# Altium project RBB_MCU7_V2.2.PrjPCB
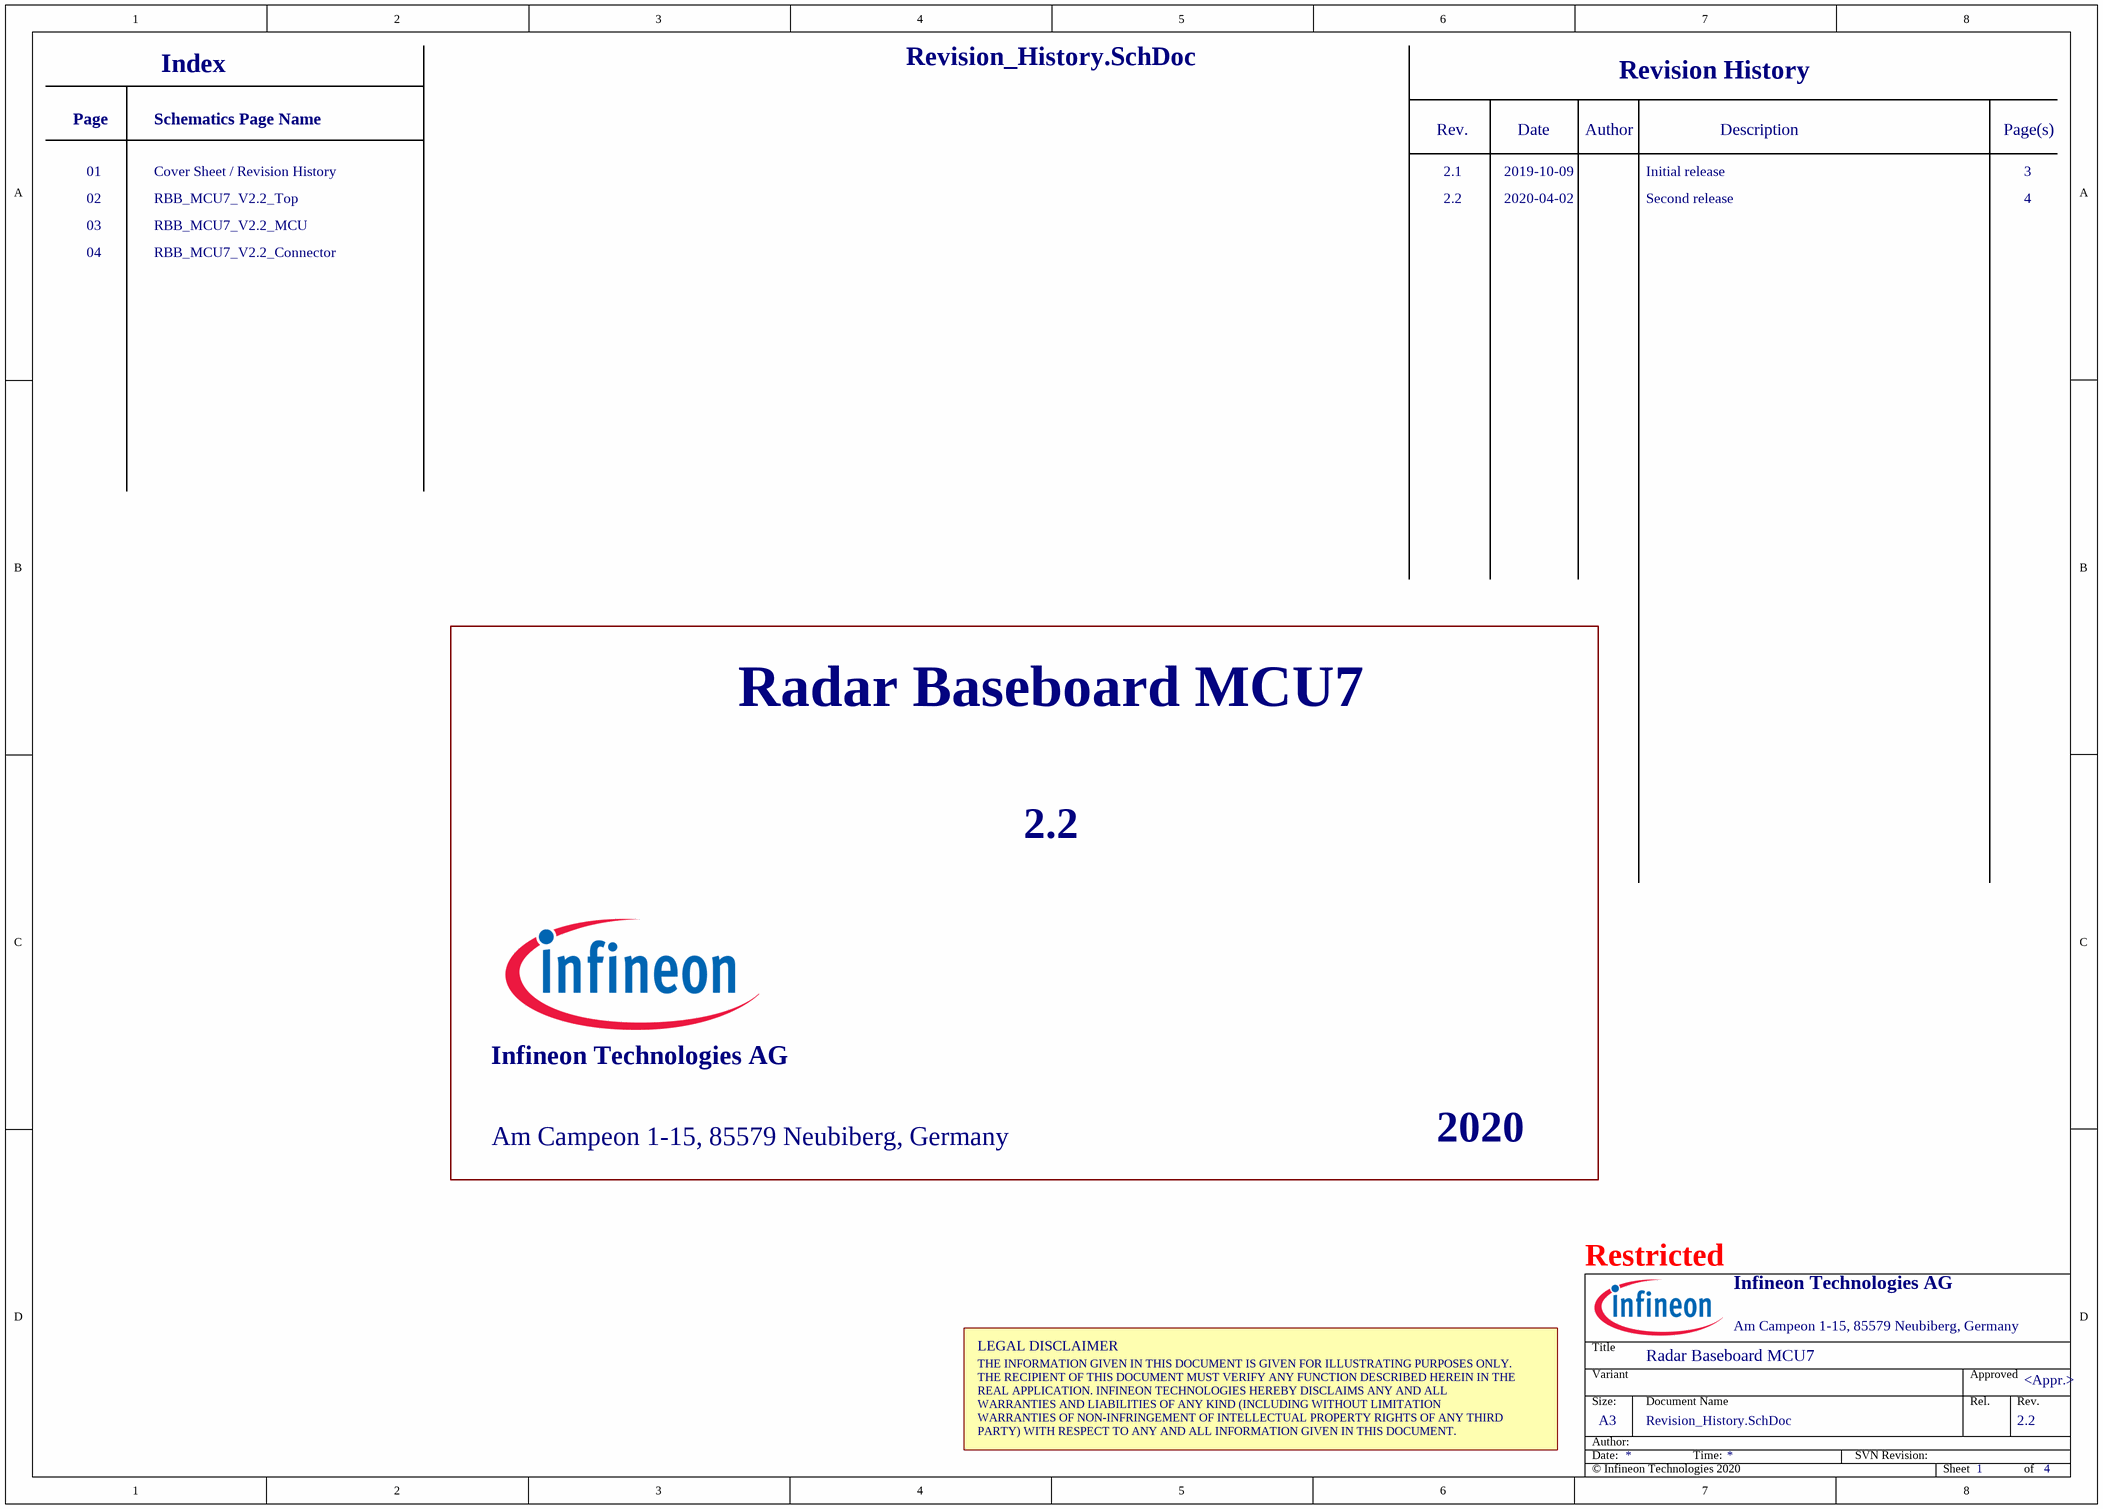
[diagram p0: Revision_History.SchDoc]
PRJ_Year: 2020; PRJ_Title: Radar Baseboard MCU7; PRJ_SCH_Revision: 2.2; PRJ_PCB_Revision: 2.2; PRJ_PCB_Release: 2.2; PRJ_Organization: Infineon Technologies AG; PRJ_Copyright: © Infineon Technologies 2020; PRJ_ConfidentialStatus: Restricted; PRJ_Address2: Am Campeon 1-15, 85579 Neubiberg, Germany
4 sheets, 154 parts. Net scope: hierarchical (ports join the sheet entries above them; power ports are global).
Board file: RBB_MCU7_V2.2.PcbDoc
Sheets:
  Revision_History.SchDoc
  RBB_MCU7_V2.2_Top.SchDoc
    1 = RBB_MCU7_V2.2_MCU.SchDoc
    2 = RBB_MCU7_V2.2_Connector.SchDoc

## Sheet Revision_History.SchDoc: Tjuefire
size A3; ApprovedBy: <Appr.>; Author: <Author>; CompanyName: Infineon Technologies AG; Engineer: <Rel.>; Organization: Infineon Technologies AG; Address1: COM AC SDC SD3; Address2: Am Campeon 1-12  -  85579 Neubiberg  -  Germany; Address3: 85579 Neubiberg; Address4: Germany; DocumentNumber: 1; Revision: <Rev.>; SheetNumber: 1; SheetTotal: 4; Release: RC00; PageSetup: Record=PageOptions|CenterHorizontal=True|CenterVertical=True|PrintScale=1.01|XCorrection=1.00|YCorrection=1.00|PrintKind=0|BorderSize=5000000|LeftOffset=0|BottomOffset=0|Orientation=2|PaperLength=1000|PaperWidth=1000|Scale=100|PaperSource=7|PrintQuality=-4|MediaType=1|DitherType=10|PaperKind=A3|PrintScaleMode=1; Doc_ConfidentialStatus: Confidential; Doc_Preliminary: Preliminary

### Notes on the sheet
- Index
- Revision History
- Page
- 01
- Cover Sheet / Revision History
- Schematics Page Name
- Rev.
- 2.1
- 2019-10-09
- Date
- Author
- Initial release
- Description
- Page(s)
- 3
- 02
- 03
- RBB_MCU7_V2.2_Top
- RBB_MCU7_V2.2_MCU
- 2.2
- 2020-04-02
- Second release
- 4
- 04
- RBB_MCU7_V2.2_Connector
- LEGAL DISCLAIMER
- THE INFORMATION GIVEN IN THIS DOCUMENT IS GIVEN FOR ILLUSTRATING PURPOSES ONLY.
  THE RECIPIENT OF THIS DOCUMENT MUST VERIFY ANY FUNCTION DESCRIBED HEREIN IN THE
  REAL APPLICATION. INFINEON TECHNOLOGIES HEREBY DISCLAIMS ANY AND ALL
  WARRANTIES AND LIABILITIES OF ANY KIND (INCLUDING WITHOUT LIMITATION
  WARRANTIES OF NON-INFRINGEMENT OF INTELLECTUAL PROPERTY RIGHTS OF ANY THIRD
  PARTY) WITH RESPECT TO ANY AND ALL INFORMATION GIVEN IN THIS DOCUMENT.
- Title
- Variant
- Approved
- Date:
- Author:
- Size:
- A3
- Document Name
- Time:
- SVN Revision:
- Rel.
- Sheet
- of

## Sheet RBB_MCU7_V2.2_Top.SchDoc: <Project Name>
size A4; ApprovedBy: <Appr.>; Author: <Author>; CompanyName: Infineon Technologies AG; Engineer: <Rel.>; Organization: Infineon Technologies AG; Address1: IFAG DES S PS; Address2: Am Campeon 1-12  -  85579 Neubiberg  -  Germany; Address3: 85579 Neubiberg; Address4: Germany; Revision: <Rev.>; SheetNumber: 2; SheetTotal: 4; Release: RC00; PageSetup: Record=PageOptions|CenterHorizontal=True|CenterVertical=True|PrintScale=1.01|XCorrection=1.00|YCorrection=1.00|PrintKind=0|BorderSize=5000000|LeftOffset=0|BottomOffset=0|Orientation=2|PaperLength=1000|PaperWidth=1000|Scale=100|PaperSource=7|PrintQuality=-4|MediaType=1|DitherType=10|PaperKind=A3|PrintScaleMode=1; Doc_ConfidentialStatus: <Doc_ConfidentialStatus>; Doc_Preliminary: <Doc_Preliminary>
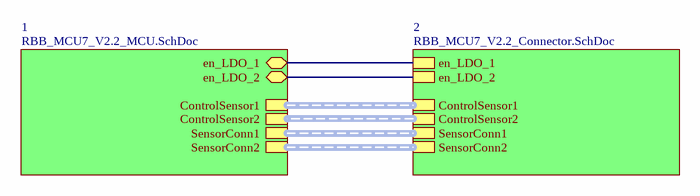
[diagram p1: RBB_MCU7_V2.2_Top.SchDoc]

### Sub-sheets
1 = RBB_MCU7_V2.2_MCU.SchDoc: en_LDO_1 (bidir), en_LDO_2 (bidir), SensorConn2 (harness SensorConn2), SensorConn1 (harness SensorConn1), ControlSensor1 (harness ControlSensor1), ControlSensor2 (harness ControlSensor2)
2 = RBB_MCU7_V2.2_Connector.SchDoc: en_LDO_1, en_LDO_2, SensorConn1 (harness SensorConn1), SensorConn2 (harness SensorConn2), ControlSensor1 (harness ControlSensor1), ControlSensor2 (harness ControlSensor2)

### Nets
en_LDO_1: sheet 1/en_LDO_1, sheet 2/en_LDO_1
en_LDO_2: sheet 1/en_LDO_2, sheet 2/en_LDO_2

### Buses and harness runs
harness sheet 1/ControlSensor1 = sheet 2/ControlSensor1
harness sheet 1/ControlSensor2 = sheet 2/ControlSensor2
harness sheet 1/SensorConn1 = sheet 2/SensorConn1
harness sheet 1/SensorConn2 = sheet 2/SensorConn2

### Notes on the sheet
- Title
- Variant
- Approved
- Date:
- Author:
- Size:
- A4
- Document Name
- Time:
- SVN Revision:
- Rel.
- Rev.
- Sheet
- of

## Sheet RBB_MCU7_V2.2_MCU.SchDoc: <Project Name>
size A3; ApprovedBy: <Appr.>; Author: <Author>; CompanyName: Infineon Technologies AG; Engineer: <Rel.>; Organization: Infineon Technologies AG; Address1: IFAG DES S PS; Address2: Am Campeon 1-12  -  85579 Neubiberg  -  Germany; Address3: 85579 Neubiberg; Address4: Germany; Revision: <Rev.>; SheetNumber: 3; SheetTotal: 4; Release: RC00; PageSetup: Record=PageOptions|CenterHorizontal=True|CenterVertical=True|PrintScale=1.01|XCorrection=1.00|YCorrection=1.00|PrintKind=0|BorderSize=5000000|LeftOffset=0|BottomOffset=0|Orientation=2|PaperLength=1000|PaperWidth=1000|Scale=100|PaperSource=7|PrintQuality=-4|MediaType=1|DitherType=10|PaperKind=A3|PrintScaleMode=1; Doc_ConfidentialStatus: <Doc_ConfidentialStatus>; Doc_Preliminary: <Doc_Preliminary>
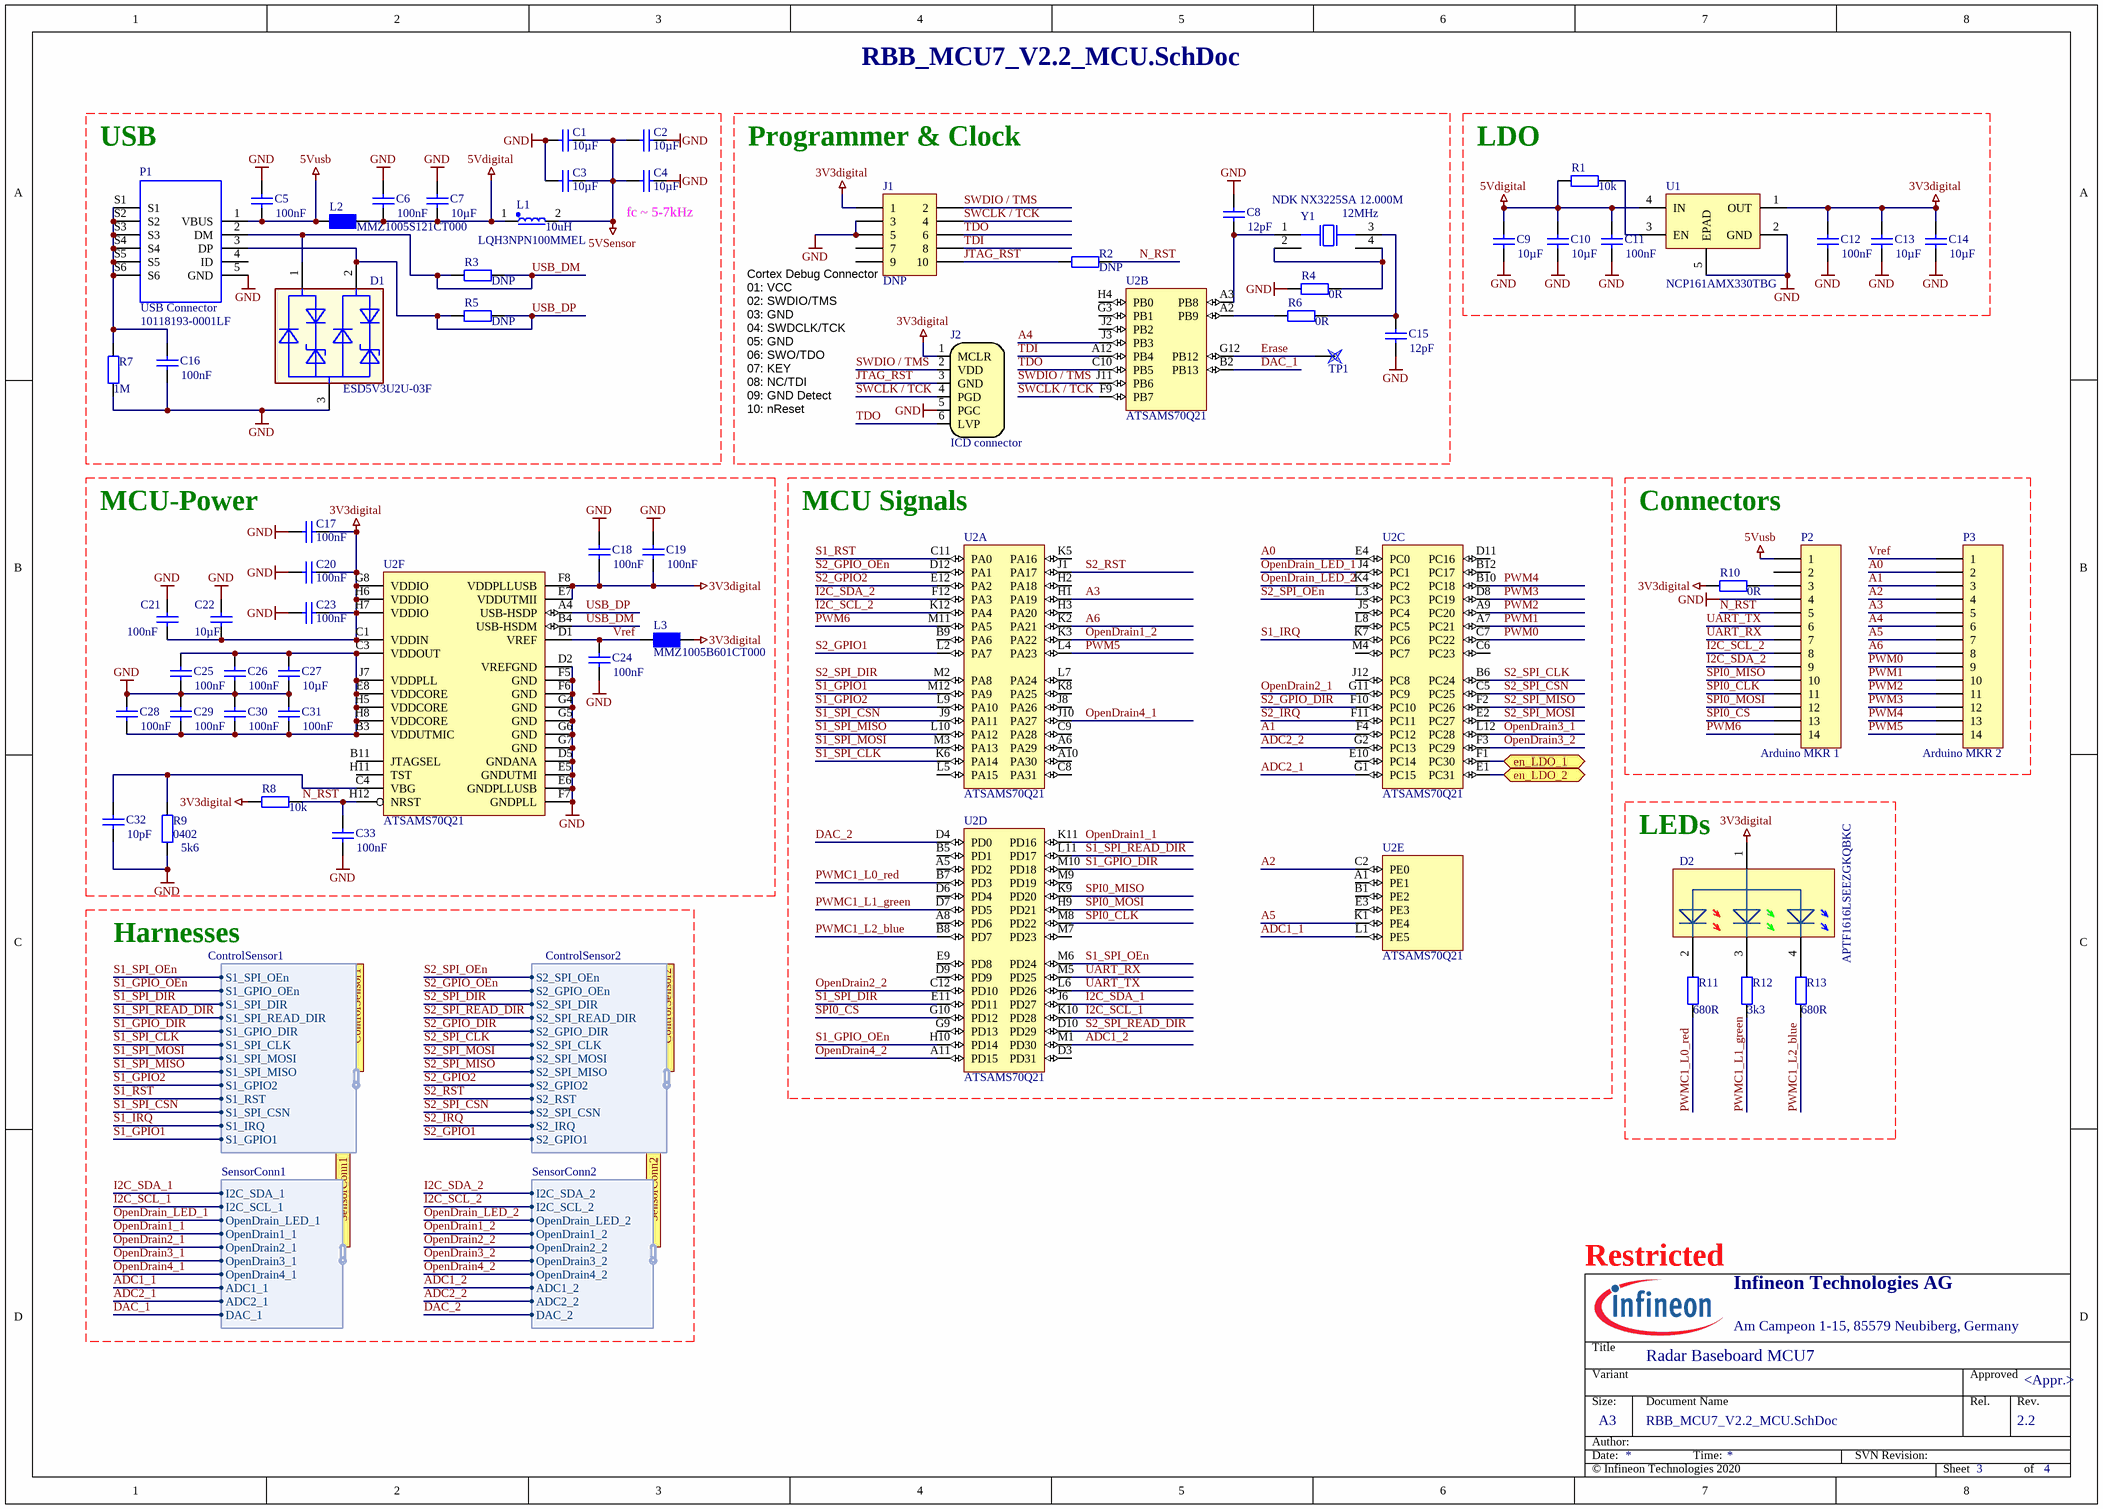
[diagram p2: RBB_MCU7_V2.2_MCU.SchDoc]

### Parts
C1  10µF  [0402_C_Axon]
C2  10µF  [0402_C_Axon]
C3  10µF  [0402_C_Axon]
C4  10µF  [0402_C_Axon]
C5  100nF  [0402_C_Axon]
C6  100nF  [0402_C_Axon]
C7  10µF  [0402_C_Axon]
C8  12pF  [0402_C_Axon]
C9  10µF  [0402_C_Axon]
C10  10µF  [0402_C_Axon]
C11  100nF  [0402_C_Axon]
C12  100nF  [0402_C_Axon]
C13  10µF  [0402_C_Axon]
C14  10µF  [0402_C_Axon]
C15  12pF  [0402_C_Axon]
C16  100nF  [0402_C_Axon]
C17  100nF  [0402_C_Axon]
C18  100nF  [0402_C_Axon]
C19  100nF  [0402_C_Axon]
C20  100nF  [0402_C_Axon]
C21  100nF  [0402_C_Axon]
C22  10µF  [0402_C_Axon]
C23  100nF  [0402_C_Axon]
C24  100nF  [0402_C_Axon]
C25  100nF  [0402_C_Axon]
C26  100nF  [0402_C_Axon]
C27  10µF  [0402_C_Axon]
C28  100nF  [0402_C_Axon]
C29  100nF  [0402_C_Axon]
C30  100nF  [0402_C_Axon]
C31  100nF  [0402_C_Axon]
C32  10pF  [0402_C_Axon]
C33  100nF  [0402_C_Axon]
D1  ESD5V3U2U-03F  [SOTFL40P120X59-3N-V]
D2  APTF1616LSEEZGKQBKC  [APTF1616LSEEZGKQBKC]
J1  DNP  [Samtec FTSH-105-01-L-DV-K - no3D]
J2  value ICD connector  [TC2030-MCP-NL]  (hidden comment: DNP)  (no BOM)
L1  LQH3NPN100MMEL  value 10uH  [INDC3030X150N_LQH3NP_MR]
L2  MMZ1005S121CT000  [0402_L_Axon]
L3  MMZ1005B601CT000  [0402_L_Axon]
P1  10118193-0001LF  value USB Connector  [CON_FCI_10118193]
P2  value Arduino MKR 1  [HDR1X14TOPBOTTOM]  (hidden comment: DNP)
P3  value Arduino MKR 2  [HDR1X14TOPBOTTOM]  (hidden comment: DNP)
R1  10k  [0402_R_Axon]
R2  DNP  [0402_Empty_Axon]
R3  DNP  [0402_Empty_Axon]
R4  0R  [0402_R_Axon]
R5  DNP  [0402_Empty_Axon]
R6  0R  [0402_R_Axon]
R7  1M  [0402_R_Axon]
R8  10k  [0402_R_Axon]
R9  5k6  value 0402  [0402_R_Axon]
R10  0R  [0402_R_Axon]
R11  680R  [0402_R_Axon]
R12  3k3  [0402_R_Axon]
R13  680R  [0402_R_Axon]
TP1  Testpoint  [TP1.5MM]  (value not drawn)  (no BOM)
U1  NCP161AMX330TBG  [NCP163]
U2  ATSAMS70Q21  [LFBGA144]  (parts A,B,C,D,E,F of 6)
Y1  12MHz  Legacy DeviceID: NDK NX3225SA 12.000M  [XTAL-SMD-NX3225SA]

### Ports
ControlSensor1 (harness ControlSensor1), ControlSensor2 (harness ControlSensor2), en_LDO_1 (bidir), en_LDO_2 (bidir), SensorConn1 (harness SensorConn1), SensorConn2 (harness SensorConn2)

### Harnesses
ControlSensor1: S1_SPI_CLK, S1_SPI_MOSI, S1_SPI_MISO, S1_GPIO2, S1_RST, S1_SPI_CSN, S1_IRQ, S1_GPIO1, S1_SPI_OEn, S1_GPIO_OEn, S1_SPI_DIR, S1_SPI_READ_DIR, S1_GPIO_DIR
SensorConn1: I2C_SDA_1, I2C_SCL_1, OpenDrain_LED_1, OpenDrain1_1, OpenDrain2_1, OpenDrain3_1, OpenDrain4_1, ADC1_1, ADC2_1, DAC_1
SensorConn2: I2C_SDA_2, I2C_SCL_2, OpenDrain_LED_2, OpenDrain1_2, OpenDrain2_2, OpenDrain3_2, OpenDrain4_2, ADC1_2, ADC2_2, DAC_2
ControlSensor2: S2_SPI_CLK, S2_SPI_MOSI, S2_SPI_MISO, S2_GPIO2, S2_RST, S2_SPI_CSN, S2_IRQ, S2_GPIO1, S2_SPI_OEn, S2_GPIO_OEn, S2_SPI_DIR, S2_SPI_READ_DIR, S2_GPIO_DIR

### Nets
3V3digital: C12.2 C13.2 C14.2 C17.1 C18.1 C19.1 C20.1 C21.1 C22.1 C23.1 D2.1 J1.1 J2.1(MCLR) L3.1 R8.1 R10.2 U1.1(OUT) U2.C1(VDDIN) U2.E7(VDDUTMII) U2.F8(VDDPLLUSB) U2.G8(VDDIO) U2.H6(VDDIO) U2.H7(VDDIO)
5Vdigital: C6.2 C7.2 C9.2 C10.2 C11.2 L1.1 L2.2 R1.2 U1.4(IN)
5VSensor: C1.2 C2.2 C3.2 C4.2 L1.2
5Vusb: C5.2 L2.1 P1.1(VBUS) P2.1
GND: C1.1 C2.1 C3.1 C4.1 C5.1 C6.1 C7.1 C8.1 C9.1 C10.1 C11.1 C12.1 C13.1 C14.1 C15.2 C16.2 C17.2 C18.2 C19.2 C20.2 C21.2 C22.2 C23.2 C24.1 C25.1 C26.1 C27.2 C28.2 C29.2 C30.2 C31.2 C32.1 C33.1 D1.3 J1.3 J1.5 J2.5(PGC) P1.5(GND) P2.4 R4.2 R7.1 R9.2 U1.2(GND) U1.5(EPAD) U2.D2(VREFGND) U2.D5(GNDANA) U2.E5(GNDUTMI) U2.E6(GNDPLLUSB) U2.F5(GND) U2.F6(GND) U2.F7(GNDPLL) U2.G4(GND) U2.G5(GND) U2.G6(GND) U2.G7(GND)
A0: P3.2 U2.E4(PC0)
A1: P3.3 U2.F4(PC12)
A2: P3.4 U2.C2(PE0)
A3: P3.5 U2.H1(PA19)
A4: P3.6 U2.J3(PB3)
A5: P3.7 U2.K1(PE4)
A6: P3.8 U2.K2(PA21)
ADC1_1: U2.L1(PE5) ; port SensorConn1.ADC1_1
ADC1_2: U2.M1(PD30) ; port SensorConn2.ADC1_2
ADC2_1: U2.G1(PC15) ; port SensorConn1.ADC2_1
ADC2_2: U2.G2(PC13) ; port SensorConn2.ADC2_2
DAC_1: U2.B2(PB13) ; port SensorConn1.DAC_1
DAC_2: U2.D4(PD0) ; port SensorConn2.DAC_2
en_LDO_1: U2.F1(PC30) ; port en_LDO_1
en_LDO_2: U2.E1(PC31) ; port en_LDO_2
Erase: TP1.1 U2.G12(PB12)
I2C_SCL_1: U2.K10(PD28) ; port SensorConn1.I2C_SCL_1
I2C_SCL_2: P2.8 U2.K12(PA4) ; port SensorConn2.I2C_SCL_2
I2C_SDA_1: U2.J6(PD27) ; port SensorConn1.I2C_SDA_1
I2C_SDA_2: P2.9 U2.F12(PA3) ; port SensorConn2.I2C_SDA_2
JTAG_RST: J1.10 J2.3(GND) R2.2
N_RST: C33.2 P2.5 R2.1 R8.2 U2.H12(NRST)
OpenDrain1_1: U2.K11(PD16) ; port SensorConn1.OpenDrain1_1
OpenDrain1_2: U2.K3(PA22) ; port SensorConn2.OpenDrain1_2
OpenDrain2_1: U2.G11(PC9) ; port SensorConn1.OpenDrain2_1
OpenDrain2_2: U2.C12(PD10) ; port SensorConn2.OpenDrain2_2
OpenDrain3_1: U2.L12(PC28) ; port SensorConn1.OpenDrain3_1
OpenDrain3_2: U2.F3(PC29) ; port SensorConn2.OpenDrain3_2
OpenDrain4_1: U2.J10(PA27) ; port SensorConn1.OpenDrain4_1
OpenDrain4_2: U2.A11(PD15) ; port SensorConn2.OpenDrain4_2
OpenDrain_LED_1: U2.J4(PC1) ; port SensorConn1.OpenDrain_LED_1
OpenDrain_LED_2: U2.K4(PC2) ; port SensorConn2.OpenDrain_LED_2
PWM0: P3.9 U2.C7(PC22)
PWM1: P3.10 U2.A7(PC21)
PWM2: P3.11 U2.A9(PC20)
PWM3: P3.12 U2.D8(PC19)
PWM4: P3.13 U2.B10(PC18)
PWM5: P3.14 U2.L4(PA23)
PWM6: P2.14 U2.M11(PA5)
PWMC1_L0_red: R11.1 U2.B7(PD3)
PWMC1_L1_green: R12.1 U2.D7(PD5)
PWMC1_L2_blue: R13.1 U2.B8(PD7)
S1_GPIO1: U2.M12(PA9) ; port ControlSensor1.S1_GPIO1
S1_GPIO2: U2.L9(PA10) ; port ControlSensor1.S1_GPIO2
S1_GPIO_DIR: U2.M10(PD18) ; port ControlSensor1.S1_GPIO_DIR
S1_GPIO_OEn: U2.H10(PD14) ; port ControlSensor1.S1_GPIO_OEn
S1_IRQ: U2.K7(PC6) ; port ControlSensor1.S1_IRQ
S1_RST: U2.C11(PA0) ; port ControlSensor1.S1_RST
S1_SPI_CLK: U2.K6(PA14) ; port ControlSensor1.S1_SPI_CLK
S1_SPI_CSN: U2.J9(PA11) ; port ControlSensor1.S1_SPI_CSN
S1_SPI_DIR: U2.E11(PD11) ; port ControlSensor1.S1_SPI_DIR
S1_SPI_MISO: U2.L10(PA12) ; port ControlSensor1.S1_SPI_MISO
S1_SPI_MOSI: U2.M3(PA13) ; port ControlSensor1.S1_SPI_MOSI
S1_SPI_OEn: U2.M6(PD24) ; port ControlSensor1.S1_SPI_OEn
S1_SPI_READ_DIR: U2.L11(PD17) ; port ControlSensor1.S1_SPI_READ_DIR
S2_GPIO1: U2.L2(PA7) ; port ControlSensor2.S2_GPIO1
S2_GPIO2: U2.E12(PA2) ; port ControlSensor2.S2_GPIO2
S2_GPIO_DIR: U2.F10(PC10) ; port ControlSensor2.S2_GPIO_DIR
S2_GPIO_OEn: U2.D12(PA1) ; port ControlSensor2.S2_GPIO_OEn
S2_IRQ: U2.F11(PC11) ; port ControlSensor2.S2_IRQ
S2_RST: U2.J1(PA17) ; port ControlSensor2.S2_RST
S2_SPI_CLK: U2.B6(PC24) ; port ControlSensor2.S2_SPI_CLK
S2_SPI_CSN: U2.C5(PC25) ; port ControlSensor2.S2_SPI_CSN
S2_SPI_DIR: U2.M2(PA8) ; port ControlSensor2.S2_SPI_DIR
S2_SPI_MISO: U2.F2(PC26) ; port ControlSensor2.S2_SPI_MISO
S2_SPI_MOSI: U2.E2(PC27) ; port ControlSensor2.S2_SPI_MOSI
S2_SPI_OEn: U2.L3(PC3) ; port ControlSensor2.S2_SPI_OEn
S2_SPI_READ_DIR: U2.D10(PD29) ; port ControlSensor2.S2_SPI_READ_DIR
SPI0_CLK: P2.11 U2.M8(PD22)
SPI0_CS: P2.13 U2.G10(PD12)
SPI0_MISO: P2.10 U2.K9(PD20)
SPI0_MOSI: P2.12 U2.H9(PD21)
SWCLK / TCK: J1.4 J2.4(PGD) U2.F9(PB7)
SWDIO / TMS: J1.2 J2.2(VDD) U2.J11(PB6)
TDI: J1.8 U2.A12(PB4)
TDO: J1.6 J2.6(LVP) U2.C10(PB5)
UART_RX: P2.7 U2.M5(PD25)
UART_TX: P2.6 U2.L6(PD26)
USB_DM: D1.1 P1.2(DM) R3.1 R3.2 U2.B4(USB-HSDM)
USB_DP: D1.2 P1.3(DP) R5.1 R5.2 U2.A4(USB-HSDP)
Vref: C24.2 L3.2 P3.1 U2.D1(VREF)
NetC8_2: C8.2 U2.A3(PB8) Y1.1
NetC15_1: C15.1 R6.1 Y1.3
NetC16_1: C16.1 P1.S1 P1.S2 P1.S3 P1.S4 P1.S5 P1.S6 R7.2
NetC25_2: C25.2 C26.2 C27.1 C28.1 C29.1 C30.1 C31.1 U2.B3(VDDUTMIC) U2.C3(VDDOUT) U2.E8(VDDCORE) U2.H5(VDDCORE) U2.H8(VDDCORE) U2.J7(VDDPLL)
NetC32_2: C32.2 R9.1 U2.C4(VBG)
NetD2_2: D2.2 R11.2
NetD2_3: D2.3 R12.2
NetD2_4: D2.4 R13.2
NetP2_3: P2.3 R10.1
NetR1_1: R1.1 U1.3(EN)
NetR4_1: R4.1 Y1.2 Y1.4
NetR6_2: R6.2 U2.A2(PB9)

Not connected (* = marked no-connect by the designer): J1 7 9; P1 4(ID); P2 2; U2 A1(PE1) A5(PD2) A6(PA29) A8(PD6) A10(PA30) B1(PE2) B5(PD1) B9(PA6) B11(JTAGSEL) B12(PC17) C6(PC23) C8(PA31) C9(PA28) D3(PD31) D6(PD4) D9(PD9) D11(PC16) E3(PE3) E9(PD8) E10(PC14) G3(PB1) G9(PD13) H2(PA18) H3(PA20) H4(PB0) H11(TST) J2(PB2) J5(PC4) J8(PA26) J12(PC8) K5(PA16) K8(PA25) L5(PA15) L7(PA24) L8(PC5) M4(PC7) M7(PD23) M9(PD19)

### Notes on the sheet
- USB
- Programmer & Clock
- LDO
- (near C4) fc ~ 5-7kHz
- (near J1) Cortex Debug Connector
- 01: VCC
- 02: SWDIO/TMS
- 03: GND
- 04: SWDCLK/TCK
- 05: GND
- 06: SWO/TDO
- 07: KEY
- 08: NC/TDI
- 09: GND Detect
- 10: nReset
- MCU-Power
- MCU Signals
- Connectors
- (near D2) LEDs
- Harnesses
- Title
- Variant
- Approved
- Date:
- Author:
- Size:
- A3
- Document Name
- Time:
- SVN Revision:
- Rel.
- Rev.
- Sheet
- of

### Library data of the parts
C1-C33 = Cap: Capacitor; Value: 0402; Published: 8-Jun-2000; LatestRevisionDate: 17-Jul-2002; LatestRevisionNote: Re-released for DXP Platform.; PackageReference: RAD-0.3; Publisher: Altium Limited; PackageDescription: Radial Cap, Thru-Hole; 2 Leads; 0.3 in Pin Spacing
D1 = 427307: Ultra-Low ESD / Transient Protection Diode, Uni-Directional, VRWM 5.3V; Legacy PartNumber: IFX01400970; Manufacturer: Infineon Technologies; Manufacturer Component Status: Active; Symbol Type: 2 Lines Uni-directional Transient Voltage Suppressor Diode, 3 Pins; Alternate View: No; Article Number: 427307; Version Number: V01; Combined Parameters: Vf:-;If:-;Ur:5.3V;Ir:50nA;Pmax:-; Type: TVS Diode; Style: Single; ComponentStatus: Released; Second Source allowed: Yes; Multiple Part: No; Legacy DeviceID: IFX01400970; Part Type: Diode; Manufacturer Order Number: ESD5V3U2U-03F; Value: ESD5V3U2U-03F; Application: Protection; Temperature min: -40; Temperature max: 125; Temperature Range: Automotive; RoHS Compliant: Y; Automotive Qualified: No; PackageReference: TSFP-3-1; ComponentLink1Description: Vendor WebSite; ComponentLink1URL: https://www.infineon.com/; ComponentLink2Description: Datasheet; ComponentLink2URL: http://webnetprod.muc.infineon.com/pcbportal_prod/WorkFlows/AltiumComponent/StandardDocumentation?Versionid=427308; Supplier 1: Farnell; Supplier 2: DigiKey; Supplier Part Number 2: ESD5V3U2U03FH6327XTSA1TR-ND; Supplier 3: Mouser; Supplier Part Number 3: 726-5V3U2U03FH6327XT
D2 = APTF1616LSEEZGKQBKC: Kingbright - APTF1616LSEEZGKQBKC
J1 = Header 5X2: Header, 5-Pin, Dual row, SMD; Bestellnummer: FTSH-105-01-L-DV-K; Hersteller: Samtec; Notes: without Pin 7; Preis: 1.525; Distributor: Samtec; FootprintBOM: SMD; Kleinmengendistributor: Samtec; KleinmengendistributorBestellnummer: FTSH-105-01-L-DV-K
J2 = TC2030-MCP-NL: Conector par ICD
L1 = 316693: for Power Line; Multiple Parts: No; Legacy PartNumber: IND00700877; Manufacturer: muRata; Manufacturer Order Number: LQH3NPN100MMR; Manufacturer Component Status: Active; Symbol Type: Inductor; Single; Standard; Polarized; Core; 2 Pins; Alternate View: Yes; Article Number: 316693; Version Number: V01; Tolerance Neg: 20%; Combined Parameters: Tol.:-20%/+20%;Rdc:252mR;Idc:1.15A;Fres:30MHz; Style: Single; Voltage DC (max): na; Legacy DeviceID: IND00700877; Part Type: Inductor; Tolerance Pos: 20%; Type: LQH3NPN100MMEL; Technology: Wire Wound; Temperature min: -40; Temperature max: 85; Temperature Range: Industrial; RoHS Compliant: Y; Automotive Qualified: No; PackageReference: 3030 (1212); ComponentLink1Description: Vendor WebSite; ComponentLink1URL: http://www.murata.com; ComponentLink2Description: Datasheet; ComponentLink2URL: http://webnetprod.muc.infineon.com/pcbportal_prod/WorkFlows/AltiumComponent/StandardDocumentation?Versionid=316694; Supplier 1: Farnell; Supplier 2: DigiKey; Supplier 3: Mouser; PLMStatus: Active; Second Source allowed: Yes; Package Description: Inductor,Chip;3.00mm L X 3.00mm W X 1.50mm H
L2 L3 = INDUCTOR1: SMD Ferrite Bead; Preis: 0; Hersteller: Würth; FootprintBOM: 0805; Kleinmengendistributor: Digi-Key; KleinmengendistributorBestellnummer: 732-1601-1-ND
P1 = FCI_10118193: USB Micro B Receptacle, Right Angle, SMD w/2 DIP Legs; Manufacturer: FCI; OrderNr: 649-10118193-0001LF; Manufacturer Part Number: 10118193-0001LF; Distributor: Mouser; ManufacturerPartNo: 10118193-0001LF; ManufacturerPartNumber: 10118193-0001LF; PackageDescription: Connector; PackageReference: USB
P2 P3 = Header 14: Header, 14-Pin; LatestRevisionDate: 17-Jul-2002; LatestRevisionNote: Re-released for DXP Platform.; Publisher: Altium Limited
R1-R8 R10-R13 = Res2: Resistor; Value: 0402
R9 = Res2: Resistor
TP1 = P_PRUEFPAD: FootprintBOM: Testpoint; Preis: -
U1 = NCP177: NCP161 - LDO 450mA, XDFN4 / ultra-low noise, high PSRR
Y1 = 409657: SMD Crystal Unit for Automotive Application, 12.000MHz; Legacy PartNumber: IC02600619; Manufacturer: Nihon Dempa Kogyo; Manufacturer Order Number: NX3225SA-12.000M-STD-CRS-2; Manufacturer Component Status: Active; Symbol type: Standard Crystal Symbol, 4 Pins; Article Number: 409657; Version Number: V01; Tolerance Neg: 50%; Combined Parameters: Standard Standard Crystal;Tol.:-50%/+50%; Style: Standard; Automotive Qualified: AEC Q200; ComponentStatus: Released; Second Source allowed: Yes; Part Type: Clock; Value: 12MHz; Tolerance Pos: 50%; Type: Crystal; Application: Standard; Temperature min: -40; Temperature max: 125; Temperature Range: Automotive; RoHS Compliant: Y; PackageReference: SMD 3.2 x 2.5 x 0.6mm; ComponentLink1Description: Vendor WebSite; ComponentLink1URL: http://www.ndk.com/en/; ComponentLink2Description: Datasheet; ComponentLink2URL: http://webnetprod.muc.infineon.com/pcbportal_prod/WorkFlows/AltiumComponent/StandardDocumentation?Versionid=409658; Supplier 1: Farnell; Supplier 2: DigiKey; Supplier Part Number 2: 644-1128-2-ND; Supplier 3: Mouser
U2 = ATSAMS70Q21: Value: ATSAMS70Q21

## Sheet RBB_MCU7_V2.2_Connector.SchDoc: <Project Name>
size A3; ApprovedBy: <Appr.>; Author: <Author>; CompanyName: Infineon Technologies AG; Engineer: <Rel.>; Organization: Infineon Technologies AG; Address1: IFAG DES S PS; Address2: Am Campeon 1-12  -  85579 Neubiberg  -  Germany; Address3: 85579 Neubiberg; Address4: Germany; Revision: <Rev.>; SheetNumber: 4; SheetTotal: 4; Release: RC00; PageSetup: Record=PageOptions|CenterHorizontal=True|CenterVertical=True|PrintScale=1.01|XCorrection=1.00|YCorrection=1.00|PrintKind=0|BorderSize=5000000|LeftOffset=0|BottomOffset=0|Orientation=2|PaperLength=1000|PaperWidth=1000|Scale=100|PaperSource=7|PrintQuality=-4|MediaType=1|DitherType=10|PaperKind=A3|PrintScaleMode=1; Doc_ConfidentialStatus: <Doc_ConfidentialStatus>; Doc_Preliminary: <Doc_Preliminary>
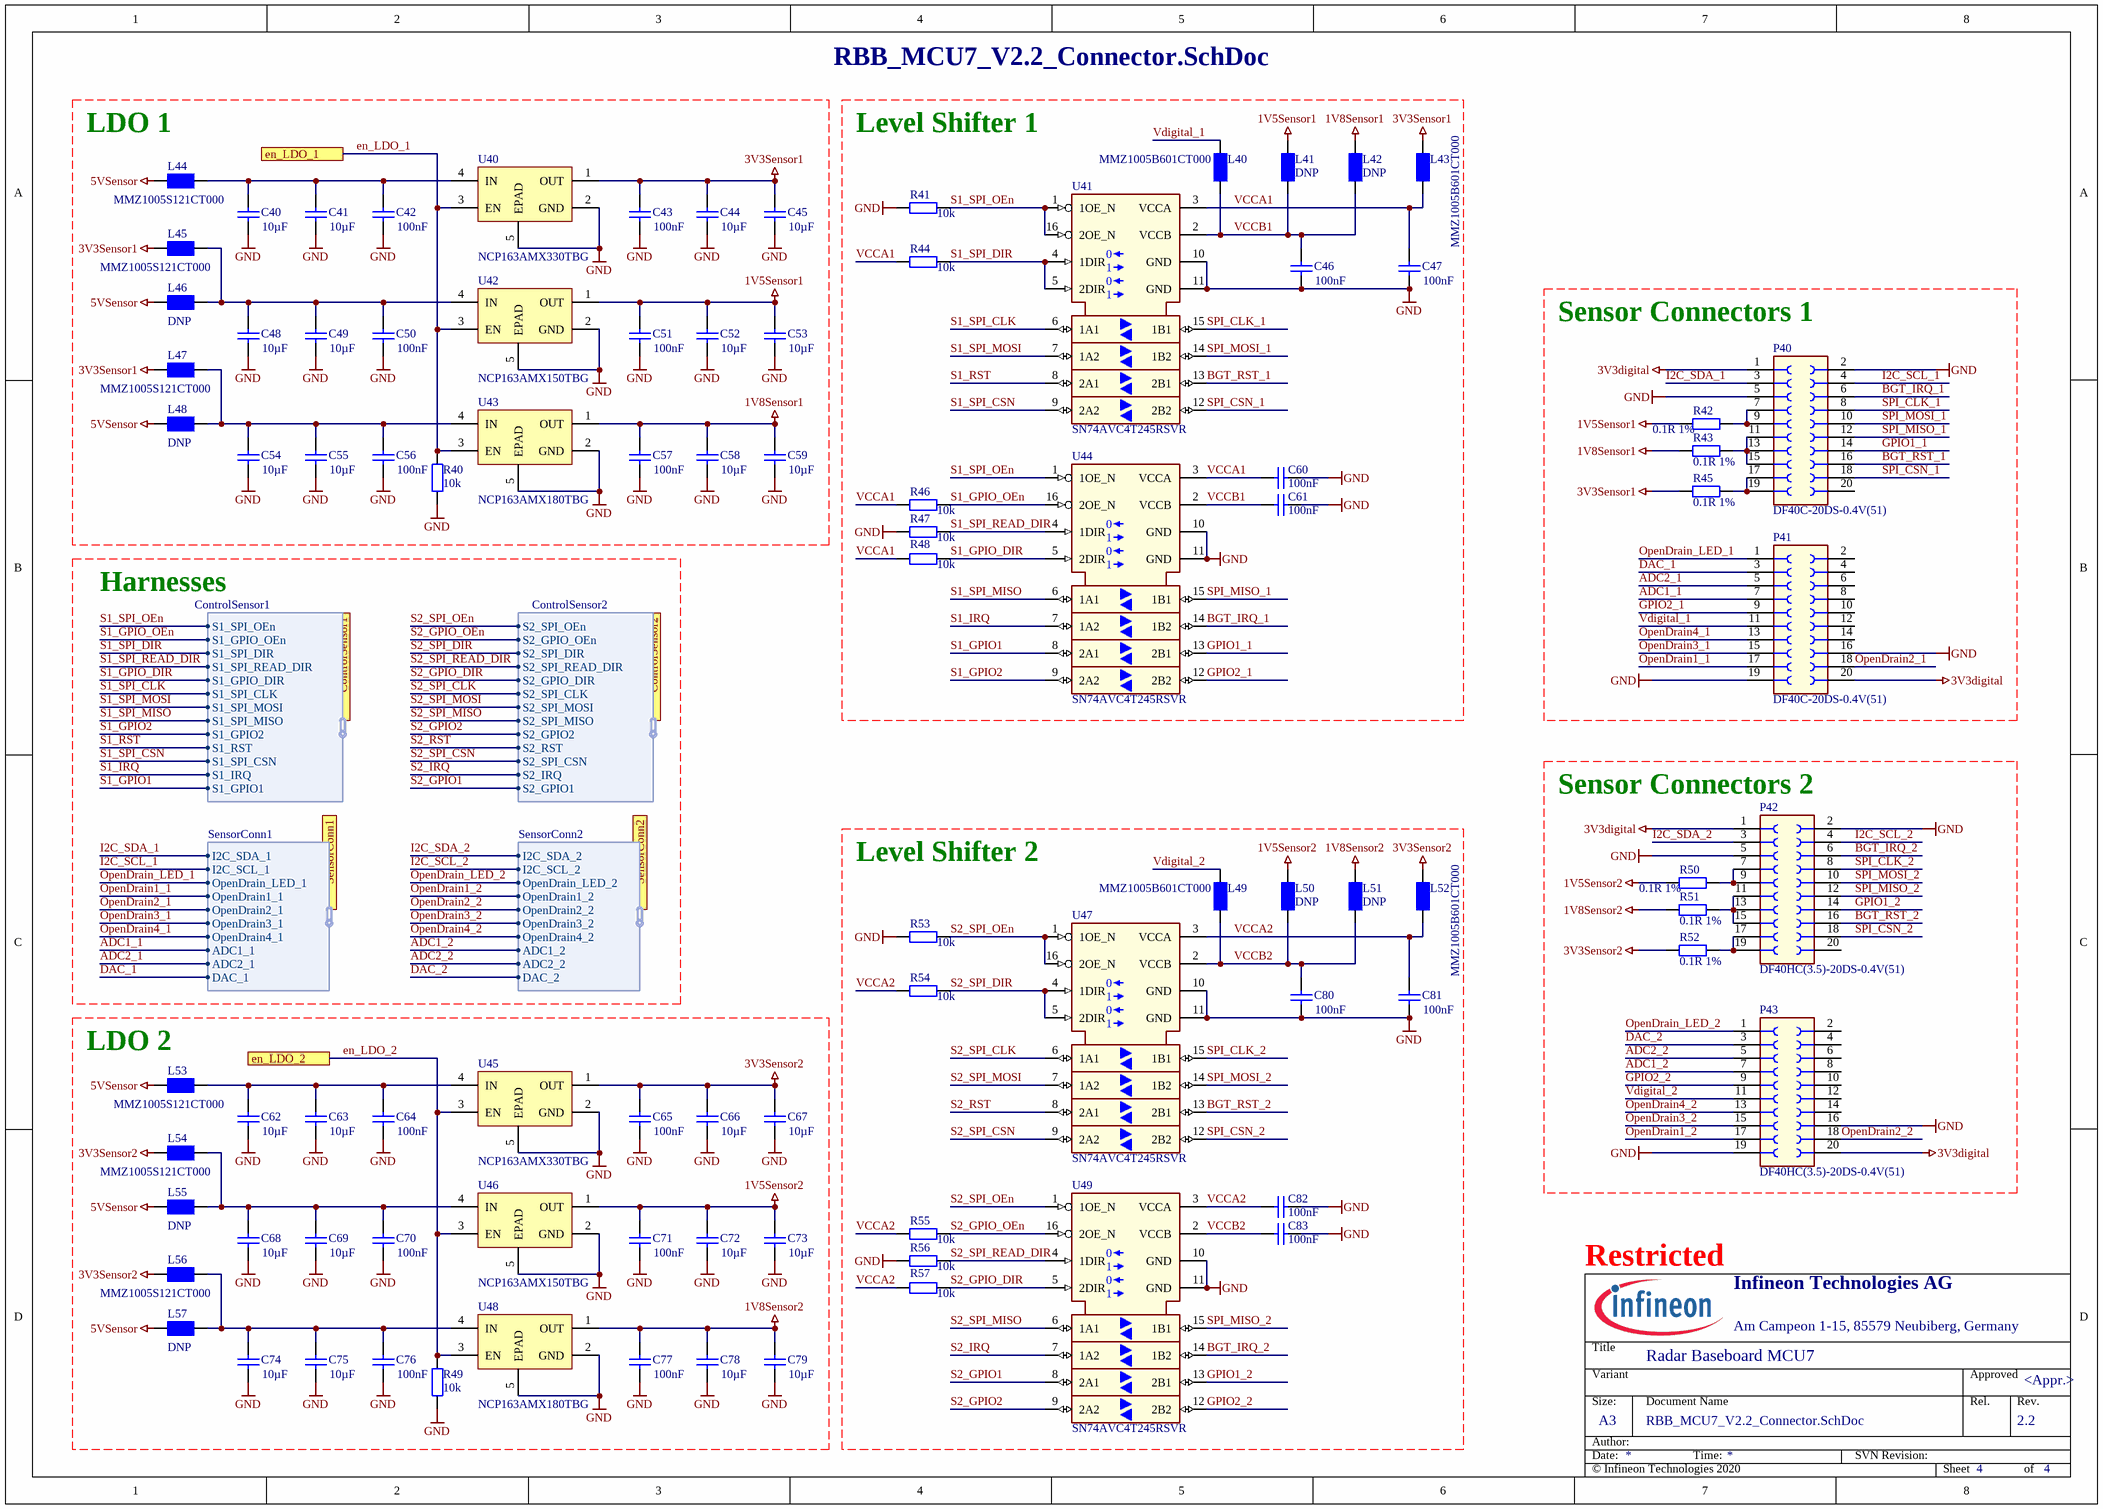
[diagram p3: RBB_MCU7_V2.2_Connector.SchDoc]

### Parts
C40  10µF  [0402_C_Axon]
C41  10µF  [0402_C_Axon]
C42  100nF  [0402_C_Axon]
C43  100nF  [0402_C_Axon]
C44  10µF  [0402_C_Axon]
C45  10µF  [0402_C_Axon]
C46  100nF  [0402_C_Axon]
C47  100nF  [0402_C_Axon]
C48  10µF  [0402_C_Axon]
C49  10µF  [0402_C_Axon]
C50  100nF  [0402_C_Axon]
C51  100nF  [0402_C_Axon]
C52  10µF  [0402_C_Axon]
C53  10µF  [0402_C_Axon]
C54  10µF  [0402_C_Axon]
C55  10µF  [0402_C_Axon]
C56  100nF  [0402_C_Axon]
C57  100nF  [0402_C_Axon]
C58  10µF  [0402_C_Axon]
C59  10µF  [0402_C_Axon]
C60  100nF  [0402_C_Axon]
C61  100nF  [0402_C_Axon]
C62  10µF  [0402_C_Axon]
C63  10µF  [0402_C_Axon]
C64  100nF  [0402_C_Axon]
C65  100nF  [0402_C_Axon]
C66  10µF  [0402_C_Axon]
C67  10µF  [0402_C_Axon]
C68  10µF  [0402_C_Axon]
C69  10µF  [0402_C_Axon]
C70  100nF  [0402_C_Axon]
C71  100nF  [0402_C_Axon]
C72  10µF  [0402_C_Axon]
C73  10µF  [0402_C_Axon]
C74  10µF  [0402_C_Axon]
C75  10µF  [0402_C_Axon]
C76  100nF  [0402_C_Axon]
C77  100nF  [0402_C_Axon]
C78  10µF  [0402_C_Axon]
C79  10µF  [0402_C_Axon]
C80  100nF  [0402_C_Axon]
C81  100nF  [0402_C_Axon]
C82  100nF  [0402_C_Axon]
C83  100nF  [0402_C_Axon]
L40  MMZ1005B601CT000  [0402_L_Axon]
L41  DNP  [0402_Empty_Axon]
L42  DNP  [0402_Empty_Axon]
L43  MMZ1005B601CT000  [0402_L_Axon]
L44  MMZ1005S121CT000  [0402_L_Axon]
L45  MMZ1005S121CT000  [0402_L_Axon]
L46  DNP  [0402_Empty_Axon]
L47  MMZ1005S121CT000  [0402_L_Axon]
L48  DNP  [0402_Empty_Axon]
L49  MMZ1005B601CT000  [0402_L_Axon]
L50  DNP  [0402_Empty_Axon]
L51  DNP  [0402_Empty_Axon]
L52  MMZ1005B601CT000  [0402_L_Axon]
L53  MMZ1005S121CT000  [0402_L_Axon]
L54  MMZ1005S121CT000  [0402_L_Axon]
L55  DNP  [0402_Empty_Axon]
L56  MMZ1005S121CT000  [0402_L_Axon]
L57  DNP  [0402_Empty_Axon]
P40  DF40C-20DS-0.4V(51)  [CON-F-SMD-DF40C-20DS-0.4V(51)]
P41  DF40C-20DS-0.4V(51)  [CON-F-SMD-DF40C-20DS-0.4V(51)]
P42  DF40HC(3.5)-20DS-0.4V(51)  [CON-F-SMD-DF40C-20DS-0.4V(51)]
P43  DF40HC(3.5)-20DS-0.4V(51)  [CON-F-SMD-DF40C-20DS-0.4V(51)]
R40  10k  [0402_R_Axon]
R41  10k  [0402_R_Axon]
R42  0.1R 1%  [0603_R_Axon]
R43  0.1R 1%  [0603_R_Axon]
R44  10k  [0402_R_Axon]
R45  0.1R 1%  [0603_R_Axon]
R46  10k  [0402_R_Axon]
R47  10k  [0402_R_Axon]
R48  10k  [0402_R_Axon]
R49  10k  [0402_R_Axon]
R50  0.1R 1%  [0603_R_Axon]
R51  0.1R 1%  [0603_R_Axon]
R52  0.1R 1%  [0603_R_Axon]
R53  10k  [0402_R_Axon]
R54  10k  [0402_R_Axon]
R55  10k  [0402_R_Axon]
R56  10k  [0402_R_Axon]
R57  10k  [0402_R_Axon]
U40  NCP163AMX330TBG  [NCP163]
U41  SN74AVC4T245RSVR  [SN74AVC4T245RSVR-Hatvan]
U42  NCP163AMX150TBG  [NCP163]
U43  NCP163AMX180TBG  [NCP163]
U44  SN74AVC4T245RSVR  [SN74AVC4T245RSVR-Hatvan]
U45  NCP163AMX330TBG  [NCP163]
U46  NCP163AMX150TBG  [NCP163]
U47  SN74AVC4T245RSVR  [SN74AVC4T245RSVR-Hatvan]
U48  NCP163AMX180TBG  [NCP163]
U49  SN74AVC4T245RSVR  [SN74AVC4T245RSVR-Hatvan]

### Ports
ControlSensor1 (harness ControlSensor1), ControlSensor2 (harness ControlSensor2), en_LDO_1, en_LDO_2, SensorConn1 (harness SensorConn1), SensorConn2 (harness SensorConn2)

### Harnesses
ControlSensor1: S1_SPI_CLK, S1_SPI_MOSI, S1_SPI_MISO, S1_GPIO2, S1_RST, S1_SPI_CSN, S1_IRQ, S1_GPIO1, S1_SPI_OEn, S1_GPIO_OEn, S1_SPI_DIR, S1_SPI_READ_DIR, S1_GPIO_DIR
SensorConn1: I2C_SDA_1, I2C_SCL_1, OpenDrain_LED_1, OpenDrain1_1, OpenDrain2_1, OpenDrain3_1, OpenDrain4_1, ADC1_1, ADC2_1, DAC_1
SensorConn2: I2C_SDA_2, I2C_SCL_2, OpenDrain_LED_2, OpenDrain1_2, OpenDrain2_2, OpenDrain3_2, OpenDrain4_2, ADC1_2, ADC2_2, DAC_2
ControlSensor2: S2_SPI_CLK, S2_SPI_MOSI, S2_SPI_MISO, S2_GPIO2, S2_RST, S2_SPI_CSN, S2_IRQ, S2_GPIO1, S2_SPI_OEn, S2_GPIO_OEn, S2_SPI_DIR, S2_SPI_READ_DIR, S2_GPIO_DIR

### Nets
1V5Sensor1: C51.2 C52.2 C53.2 L41.2 R42.2 U42.1(OUT)
1V5Sensor2: C71.2 C72.2 C73.2 L50.2 R50.2 U46.1(OUT)
1V8Sensor1: C57.2 C58.2 C59.2 L42.2 R43.2 U43.1(OUT)
1V8Sensor2: C77.2 C78.2 C79.2 L51.2 R51.2 U48.1(OUT)
3V3digital: P40.1 P41.20 P42.1 P43.20
3V3Sensor1: C43.2 C44.2 C45.2 L43.2 L45.1 L47.1 R45.2 U40.1(OUT)
3V3Sensor2: C65.2 C66.2 C67.2 L52.2 L54.1 L56.1 R52.2 U45.1(OUT)
5VSensor: L44.1 L46.1 L48.1 L53.1 L55.1 L57.1
GND: C40.1 C41.1 C42.1 C43.1 C44.1 C45.1 C46.1 C47.1 C48.1 C49.1 C50.1 C51.1 C52.1 C53.1 C54.1 C55.1 C56.1 C57.1 C58.1 C59.1 C60.1 C61.1 C62.1 C63.1 C64.1 C65.1 C66.1 C67.1 C68.1 C69.1 C70.1 C71.1 C72.1 C73.1 C74.1 C75.1 C76.1 C77.1 C78.1 C79.1 C80.1 C81.1 C82.1 C83.1 P40.2 P40.5 P41.16 P41.19 P42.2 P42.5 P43.16 P43.19 R40.2 R41.1 R47.1 R49.2 R53.1 R56.1 U40.2(GND) U40.5(EPAD) U41.10(GND) U41.11(GND) U42.2(GND) U42.5(EPAD) U43.2(GND) U43.5(EPAD) U44.10(GND) U44.11(GND) U45.2(GND) U45.5(EPAD) U46.2(GND) U46.5(EPAD) U47.10(GND) U47.11(GND) U48.2(GND) U48.5(EPAD) U49.10(GND) U49.11(GND)
ADC1_1: P41.7 ; port SensorConn1.ADC1_1
ADC1_2: P43.7 ; port SensorConn2.ADC1_2
ADC2_1: P41.5 ; port SensorConn1.ADC2_1
ADC2_2: P43.5 ; port SensorConn2.ADC2_2
BGT_IRQ_1: P40.6 U44.14(1B2)
BGT_IRQ_2: P42.6 U49.14(1B2)
BGT_RST_1: P40.16 U41.13(2B1)
BGT_RST_2: P42.16 U47.13(2B1)
DAC_1: P41.3 ; port SensorConn1.DAC_1
DAC_2: P43.3 ; port SensorConn2.DAC_2
en_LDO_1: R40.1 U40.3(EN) U42.3(EN) U43.3(EN) ; port en_LDO_1
en_LDO_2: R49.1 U45.3(EN) U46.3(EN) U48.3(EN) ; port en_LDO_2
GPIO1_1: P40.14 U44.13(2B1)
GPIO1_2: P42.14 U49.13(2B1)
GPIO2_1: P41.9 U44.12(2B2)
GPIO2_2: P43.9 U49.12(2B2)
I2C_SCL_1: P40.4 ; port SensorConn1.I2C_SCL_1
I2C_SCL_2: P42.4 ; port SensorConn2.I2C_SCL_2
I2C_SDA_1: P40.3 ; port SensorConn1.I2C_SDA_1
I2C_SDA_2: P42.3 ; port SensorConn2.I2C_SDA_2
OpenDrain1_1: P41.17 ; port SensorConn1.OpenDrain1_1
OpenDrain1_2: P43.17 ; port SensorConn2.OpenDrain1_2
OpenDrain2_1: P41.18 ; port SensorConn1.OpenDrain2_1
OpenDrain2_2: P43.18 ; port SensorConn2.OpenDrain2_2
OpenDrain3_1: P41.15 ; port SensorConn1.OpenDrain3_1
OpenDrain3_2: P43.15 ; port SensorConn2.OpenDrain3_2
OpenDrain4_1: P41.13 ; port SensorConn1.OpenDrain4_1
OpenDrain4_2: P43.13 ; port SensorConn2.OpenDrain4_2
OpenDrain_LED_1: P41.1 ; port SensorConn1.OpenDrain_LED_1
OpenDrain_LED_2: P43.1 ; port SensorConn2.OpenDrain_LED_2
S1_GPIO1: U44.8(2A1) ; port ControlSensor1.S1_GPIO1
S1_GPIO2: U44.9(2A2) ; port ControlSensor1.S1_GPIO2
S1_GPIO_DIR: R48.2 U44.5(2DIR) ; port ControlSensor1.S1_GPIO_DIR
S1_GPIO_OEn: R46.2 U44.16(2OE_N) ; port ControlSensor1.S1_GPIO_OEn
S1_IRQ: U44.7(1A2) ; port ControlSensor1.S1_IRQ
S1_RST: U41.8(2A1) ; port ControlSensor1.S1_RST
S1_SPI_CLK: U41.6(1A1) ; port ControlSensor1.S1_SPI_CLK
S1_SPI_CSN: U41.9(2A2) ; port ControlSensor1.S1_SPI_CSN
S1_SPI_DIR: R44.2 U41.4(1DIR) U41.5(2DIR) ; port ControlSensor1.S1_SPI_DIR
S1_SPI_MISO: U44.6(1A1) ; port ControlSensor1.S1_SPI_MISO
S1_SPI_MOSI: U41.7(1A2) ; port ControlSensor1.S1_SPI_MOSI
S1_SPI_OEn: R41.2 U41.1(1OE_N) U41.16(2OE_N) U44.1(1OE_N) ; port ControlSensor1.S1_SPI_OEn
S1_SPI_READ_DIR: R47.2 U44.4(1DIR) ; port ControlSensor1.S1_SPI_READ_DIR
S2_GPIO1: U49.8(2A1) ; port ControlSensor2.S2_GPIO1
S2_GPIO2: U49.9(2A2) ; port ControlSensor2.S2_GPIO2
S2_GPIO_DIR: R57.2 U49.5(2DIR) ; port ControlSensor2.S2_GPIO_DIR
S2_GPIO_OEn: R55.2 U49.16(2OE_N) ; port ControlSensor2.S2_GPIO_OEn
S2_IRQ: U49.7(1A2) ; port ControlSensor2.S2_IRQ
S2_RST: U47.8(2A1) ; port ControlSensor2.S2_RST
S2_SPI_CLK: U47.6(1A1) ; port ControlSensor2.S2_SPI_CLK
S2_SPI_CSN: U47.9(2A2) ; port ControlSensor2.S2_SPI_CSN
S2_SPI_DIR: R54.2 U47.4(1DIR) U47.5(2DIR) ; port ControlSensor2.S2_SPI_DIR
S2_SPI_MISO: U49.6(1A1) ; port ControlSensor2.S2_SPI_MISO
S2_SPI_MOSI: U47.7(1A2) ; port ControlSensor2.S2_SPI_MOSI
S2_SPI_OEn: R53.2 U47.1(1OE_N) U47.16(2OE_N) U49.1(1OE_N) ; port ControlSensor2.S2_SPI_OEn
S2_SPI_READ_DIR: R56.2 U49.4(1DIR) ; port ControlSensor2.S2_SPI_READ_DIR
SPI_CLK_1: P40.8 U41.15(1B1)
SPI_CLK_2: P42.8 U47.15(1B1)
SPI_CSN_1: P40.18 U41.12(2B2)
SPI_CSN_2: P42.18 U47.12(2B2)
SPI_MISO_1: P40.12 U44.15(1B1)
SPI_MISO_2: P42.12 U49.15(1B1)
SPI_MOSI_1: P40.10 U41.14(1B2)
SPI_MOSI_2: P42.10 U47.14(1B2)
VCCA1: C47.2 C60.2 L43.1 R44.1 R46.1 R48.1 U41.3(VCCA) U44.3(VCCA)
VCCA2: C81.2 C82.2 L52.1 R54.1 R55.1 R57.1 U47.3(VCCA) U49.3(VCCA)
VCCB1: C46.2 C61.2 L40.1 L41.1 L42.1 U41.2(VCCB) U44.2(VCCB)
VCCB2: C80.2 C83.2 L49.1 L50.1 L51.1 U47.2(VCCB) U49.2(VCCB)
Vdigital_1: L40.2 P41.11
Vdigital_2: L49.2 P43.11
NetC40_2: C40.2 C41.2 C42.2 L44.2 U40.4(IN)
NetC48_2: C48.2 C49.2 C50.2 L45.2 L46.2 U42.4(IN)
NetC54_2: C54.2 C55.2 C56.2 L47.2 L48.2 U43.4(IN)
NetC62_2: C62.2 C63.2 C64.2 L53.2 U45.4(IN)
NetC68_2: C68.2 C69.2 C70.2 L54.2 L55.2 U46.4(IN)
NetC74_2: C74.2 C75.2 C76.2 L56.2 L57.2 U48.4(IN)
NetP40_7: P40.7 P40.9 R42.1
NetP40_11: P40.11 P40.13 P40.15 R43.1
NetP40_17: P40.17 P40.19 R45.1
NetP42_7: P42.7 P42.9 R50.1
NetP42_11: P42.11 P42.13 P42.15 R51.1
NetP42_17: P42.17 P42.19 R52.1

Not connected (* = marked no-connect by the designer): P40 20; P41 2 4 6 8 10 12 14; P42 20; P43 2 4 6 8 10 12 14

### Notes on the sheet
- (near L44) LDO 1
- Level Shifter 1
- (near P40) Sensor Connectors 1
- Harnesses
- (near P42) Sensor Connectors 2
- Level Shifter 2
- (near L53) LDO 2
- Title
- Variant
- Approved
- Date:
- Author:
- Size:
- A3
- Document Name
- Time:
- SVN Revision:
- Rel.
- Rev.
- Sheet
- of
- (in symbol 465616) 0

### Library data of the parts
C40-C83 = Cap: Capacitor; Value: 0402; Published: 8-Jun-2000; LatestRevisionDate: 17-Jul-2002; LatestRevisionNote: Re-released for DXP Platform.; PackageReference: RAD-0.3; Publisher: Altium Limited; PackageDescription: Radial Cap, Thru-Hole; 2 Leads; 0.3 in Pin Spacing
L40-L57 = INDUCTOR1: as L2 on sheet RBB_MCU7_V2.2_MCU; FootprintBOM: 0805; Kleinmengendistributor: Digi-Key; KleinmengendistributorBestellnummer: 732-1601-1-ND
P40 P41 = 526510: Board-to-FPC Connector, 0.4mm pitch, Female; Manufacturer: Hirose Connectors; Manufacturer Component Status: Active; Symbol type: Socket 10X2 pins; Article Number: 526510; Version Number: V01; Legacy DeviceID: HRS_DF40C-20DS-0.4V(51); Combined Parameters: Board-to-Board Socket (female);10x2;Mounting:SMT;Orient:0° (vertical);Shielded:No; QuickPick: 0° (vertical) / Board-to-Board; Style: FFC/FPC; Automotive Qualified: No; ComponentStatus: Released; Second Source allowed: Yes; Voltage DC (max): na; Part Type: Connector; Manufacturer Order Number: DF40C-20DS-0.4V(51); Value: DF40C-20DS-0.4V(51); Type: Board-to-Board; Temperature min: -35; Temperature max: 85; Temperature Range: Military; ROHS Compliant: Y; PackageReference: SMD; ComponentLink1Description: Vendor WebSite; ComponentLink1URL: http://www.hirose.com/; ComponentLink2Description: Datasheet; ComponentLink2URL: http://webnetprod.muc.infineon.com/PCBPortal_Prod/WorkFlows/AltiumComponent/StandardDocumentation?Versionid=526511; Supplier 1: Farnell; Supplier Part Number 1: 2427683; Supplier 2: DigiKey; Supplier Part Number 2: H11619CT-ND; Supplier 3: Mouser; Supplier Part Number 3: 798-DF40C20DS0.4V51; PLMStatus: Active; Package Description: Connector, SMD, 0.4 mm pitch, 20 pin, 6.60 mm L X 2.88 mm W X 1.60 mm H body
P42 P43 = 526510: Board-to-FPC Connector, 0.4mm pitch, Female; Manufacturer: Hirose Connectors; Manufacturer Component Status: Active; Symbol type: Socket 10X2 pins; Article Number: 526510; Version Number: V01; Legacy DeviceID: HRS_DF40HC(3.5)-20DS-0.4V(51); Combined Parameters: Board-to-Board Socket (female);10x2;Mounting:SMT;Orient:0° (vertical);Shielded:No; QuickPick: 0° (vertical) / Board-to-Board; Style: FFC/FPC; Automotive Qualified: No; ComponentStatus: Released; Second Source allowed: Yes; Voltage DC (max): na; Part Type: Connector; Manufacturer Order Number: DF40HC(3.5)-20DS-0.4V(51); Value: DF40HC(3.5)-20DS-0.4V(51); Type: Board-to-Board; Temperature min: -35; Temperature max: 85; Temperature Range: Military; ROHS Compliant: Y; PackageReference: SMD; ComponentLink1Description: Vendor WebSite; ComponentLink1URL: http://www.hirose.com/; ComponentLink2Description: Datasheet; ComponentLink2URL: http://webnetprod.muc.infineon.com/PCBPortal_Prod/WorkFlows/AltiumComponent/StandardDocumentation?Versionid=526511; Supplier 1: Farnell; Supplier 2: DigiKey; Supplier Part Number 2: DF40HC(3.5)-20DS-0.4V(51)-ND; Supplier 3: Mouser; Supplier Part Number 3: 798-DF40HC3520DS04V5; PLMStatus: Active; Package Description: Connector, SMD, 0.4 mm pitch, 20 pin, 6.60 mm L X 2.88 mm W X 3.50 mm H body
R40 R41 R44 R46-R49 R53-R57 = Res2: Resistor; Value: 0402
R42 R43 R45 R50-R52 = Res2: Resistor; Value: 0603; Published: 8-Jun-2000; LatestRevisionDate: 17-Jul-2002; LatestRevisionNote: Re-released for DXP Platform.; PackageReference: AXIAL-0.4; Publisher: Altium Limited; PackageDescription: Axial Device, Thru-Hole; 2 Leads; 0.4 in Pin Spacing
U40 U42 U43 U45 U46 U48 = NCP177: NCP163 - LDO 250mA, XDFN4, / ultra-low noise, high PSRR
U41 U44 U47 U49 = 465616: Dual-Bit Bus Transceiver with Configurable Voltage Translation and 3-State Output; Multiple Parts: No; Legacy PartNumber: IC02601282; Manufacturer: Texas Instruments; Manufacturer Component Status: Active; Article Number: 465616; Version Number: V01; Legacy DeviceID: TI_SN74AVC4T245RSVR; Combined Parameters: Industrial Interface/Transceiver;Vdc min/max:1.2V/3.6V;Iout:50mA;Fmax:100MHz; Second Source allowed: Yes; Voltage DC (max): na; Symbol Type: Dual-Bit Bus Transceiver with Configurable Voltage Translation and 3-State Output; Alternate View: No; Part Type: Integrated Circuit; Manufacturer Order Number: SN74AVC4T245RSVR; Value: SN74AVC4T245RSVR; Type: Interface/Transceiver; Application: Industrial; Temperature min: -40; Temperature max: 85; Temperature Range: Industrial; RoHS Compliant: Y; Automotive Qualified: No; PackageReference: UQFN-16 (RSV); ComponentLink1Description: Vendor WebSite; ComponentLink1URL: http://www.ti.com; ComponentLink2Description: Datasheet; ComponentLink2URL: http://webnetprod.muc.infineon.com/pcbportal_prod/WorkFlows/AltiumComponent/StandardDocumentation?Versionid=465617; Supplier 1: Farnell; Supplier Part Number 1: 2436915; Supplier 2: DigiKey; Supplier Part Number 2: 296-24366-2-ND; Supplier 3: Mouser; Supplier Part Number 3: 595-SN74AVC4T245RSVR; PLMStatus: Active; Package Description: UQFN, 16 Pins, 2.6mm L X 1.8mm W X 0.55mm H body

## Nets that join several sheets
3V3digital: RBB_MCU7_V2.2_MCU (23 pins), RBB_MCU7_V2.2_Connector (P40.1 P41.20 P42.1 P43.20)
5VSensor: RBB_MCU7_V2.2_MCU (5 pins), RBB_MCU7_V2.2_Connector (6 pins)
GND: RBB_MCU7_V2.2_MCU (55 pins), RBB_MCU7_V2.2_Connector (78 pins)
ADC1_1: RBB_MCU7_V2.2_MCU (U2.L1), RBB_MCU7_V2.2_Connector (P41.7)
ADC1_2: RBB_MCU7_V2.2_MCU (U2.M1), RBB_MCU7_V2.2_Connector (P43.7)
ADC2_1: RBB_MCU7_V2.2_MCU (U2.G1), RBB_MCU7_V2.2_Connector (P41.5)
ADC2_2: RBB_MCU7_V2.2_MCU (U2.G2), RBB_MCU7_V2.2_Connector (P43.5)
DAC_1: RBB_MCU7_V2.2_MCU (U2.B2), RBB_MCU7_V2.2_Connector (P41.3)
DAC_2: RBB_MCU7_V2.2_MCU (U2.D4), RBB_MCU7_V2.2_Connector (P43.3)
en_LDO_1: RBB_MCU7_V2.2_MCU (U2.F1), RBB_MCU7_V2.2_Connector (R40.1 U40.3 U42.3 U43.3)
en_LDO_2: RBB_MCU7_V2.2_MCU (U2.E1), RBB_MCU7_V2.2_Connector (R49.1 U45.3 U46.3 U48.3)
I2C_SCL_1: RBB_MCU7_V2.2_MCU (U2.K10), RBB_MCU7_V2.2_Connector (P40.4)
I2C_SCL_2: RBB_MCU7_V2.2_MCU (P2.8 U2.K12), RBB_MCU7_V2.2_Connector (P42.4)
I2C_SDA_1: RBB_MCU7_V2.2_MCU (U2.J6), RBB_MCU7_V2.2_Connector (P40.3)
I2C_SDA_2: RBB_MCU7_V2.2_MCU (P2.9 U2.F12), RBB_MCU7_V2.2_Connector (P42.3)
OpenDrain1_1: RBB_MCU7_V2.2_MCU (U2.K11), RBB_MCU7_V2.2_Connector (P41.17)
OpenDrain1_2: RBB_MCU7_V2.2_MCU (U2.K3), RBB_MCU7_V2.2_Connector (P43.17)
OpenDrain2_1: RBB_MCU7_V2.2_MCU (U2.G11), RBB_MCU7_V2.2_Connector (P41.18)
OpenDrain2_2: RBB_MCU7_V2.2_MCU (U2.C12), RBB_MCU7_V2.2_Connector (P43.18)
OpenDrain3_1: RBB_MCU7_V2.2_MCU (U2.L12), RBB_MCU7_V2.2_Connector (P41.15)
OpenDrain3_2: RBB_MCU7_V2.2_MCU (U2.F3), RBB_MCU7_V2.2_Connector (P43.15)
OpenDrain4_1: RBB_MCU7_V2.2_MCU (U2.J10), RBB_MCU7_V2.2_Connector (P41.13)
OpenDrain4_2: RBB_MCU7_V2.2_MCU (U2.A11), RBB_MCU7_V2.2_Connector (P43.13)
OpenDrain_LED_1: RBB_MCU7_V2.2_MCU (U2.J4), RBB_MCU7_V2.2_Connector (P41.1)
OpenDrain_LED_2: RBB_MCU7_V2.2_MCU (U2.K4), RBB_MCU7_V2.2_Connector (P43.1)
S1_GPIO1: RBB_MCU7_V2.2_MCU (U2.M12), RBB_MCU7_V2.2_Connector (U44.8)
S1_GPIO2: RBB_MCU7_V2.2_MCU (U2.L9), RBB_MCU7_V2.2_Connector (U44.9)
S1_GPIO_DIR: RBB_MCU7_V2.2_MCU (U2.M10), RBB_MCU7_V2.2_Connector (R48.2 U44.5)
S1_GPIO_OEn: RBB_MCU7_V2.2_MCU (U2.H10), RBB_MCU7_V2.2_Connector (R46.2 U44.16)
S1_IRQ: RBB_MCU7_V2.2_MCU (U2.K7), RBB_MCU7_V2.2_Connector (U44.7)
S1_RST: RBB_MCU7_V2.2_MCU (U2.C11), RBB_MCU7_V2.2_Connector (U41.8)
S1_SPI_CLK: RBB_MCU7_V2.2_MCU (U2.K6), RBB_MCU7_V2.2_Connector (U41.6)
S1_SPI_CSN: RBB_MCU7_V2.2_MCU (U2.J9), RBB_MCU7_V2.2_Connector (U41.9)
S1_SPI_DIR: RBB_MCU7_V2.2_MCU (U2.E11), RBB_MCU7_V2.2_Connector (R44.2 U41.4 U41.5)
S1_SPI_MISO: RBB_MCU7_V2.2_MCU (U2.L10), RBB_MCU7_V2.2_Connector (U44.6)
S1_SPI_MOSI: RBB_MCU7_V2.2_MCU (U2.M3), RBB_MCU7_V2.2_Connector (U41.7)
S1_SPI_OEn: RBB_MCU7_V2.2_MCU (U2.M6), RBB_MCU7_V2.2_Connector (R41.2 U41.1 U41.16 U44.1)
S1_SPI_READ_DIR: RBB_MCU7_V2.2_MCU (U2.L11), RBB_MCU7_V2.2_Connector (R47.2 U44.4)
S2_GPIO1: RBB_MCU7_V2.2_MCU (U2.L2), RBB_MCU7_V2.2_Connector (U49.8)
S2_GPIO2: RBB_MCU7_V2.2_MCU (U2.E12), RBB_MCU7_V2.2_Connector (U49.9)
S2_GPIO_DIR: RBB_MCU7_V2.2_MCU (U2.F10), RBB_MCU7_V2.2_Connector (R57.2 U49.5)
S2_GPIO_OEn: RBB_MCU7_V2.2_MCU (U2.D12), RBB_MCU7_V2.2_Connector (R55.2 U49.16)
S2_IRQ: RBB_MCU7_V2.2_MCU (U2.F11), RBB_MCU7_V2.2_Connector (U49.7)
S2_RST: RBB_MCU7_V2.2_MCU (U2.J1), RBB_MCU7_V2.2_Connector (U47.8)
S2_SPI_CLK: RBB_MCU7_V2.2_MCU (U2.B6), RBB_MCU7_V2.2_Connector (U47.6)
S2_SPI_CSN: RBB_MCU7_V2.2_MCU (U2.C5), RBB_MCU7_V2.2_Connector (U47.9)
S2_SPI_DIR: RBB_MCU7_V2.2_MCU (U2.M2), RBB_MCU7_V2.2_Connector (R54.2 U47.4 U47.5)
S2_SPI_MISO: RBB_MCU7_V2.2_MCU (U2.F2), RBB_MCU7_V2.2_Connector (U49.6)
S2_SPI_MOSI: RBB_MCU7_V2.2_MCU (U2.E2), RBB_MCU7_V2.2_Connector (U47.7)
S2_SPI_OEn: RBB_MCU7_V2.2_MCU (U2.L3), RBB_MCU7_V2.2_Connector (R53.2 U47.1 U47.16 U49.1)
S2_SPI_READ_DIR: RBB_MCU7_V2.2_MCU (U2.D10), RBB_MCU7_V2.2_Connector (R56.2 U49.4)